# Altium schematic sheet balloon_system.SchDoc
size A4
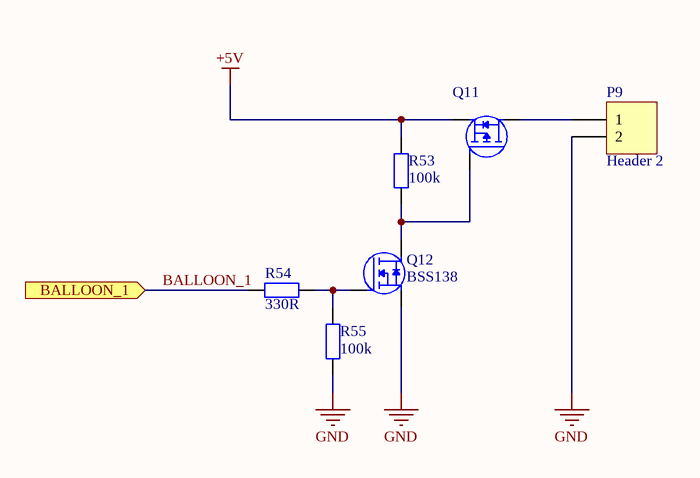
[diagram p0: balloon_system.SchDoc]

## Parts
P9  Header 2  [HDR1X2]  (no BOM)
Q11  SISH625DN-T1-GE3  [SISH625DN]  (value not drawn)  (no BOM)
Q12  BSS138  [SOT23]  (no BOM)
R53  100k  [R0603_IPC_MD]  (no BOM)
R54  330R  [R0603_IPC_MD]  (no BOM)
R55  100k  [R0603_IPC_MD]  (no BOM)

## Ports
BALLOON_1 (in)

## Nets
+5V: Q11.1(S) R53.1
GND: P9.2 Q12.2(S) R55.2
BALLOON_1: R54.2 ; port BALLOON_1
NetP9_1: P9.1 Q11.3(D)
NetQ11_2: Q11.2(G) Q12.3(D) R53.2
NetQ12_1: Q12.1(G) R54.1 R55.1

## Library data of the parts
P9 = Header 2: Header, 2-Pin; LatestRevisionDate: 17-Jul-2002; LatestRevisionNote: Re-released for DXP Platform.; Publisher: Altium Limited
Q11 = SISH625DN-T1: P-Channel 30V 17.3A (Ta), 35A (Tc) 3.7W (Ta), 52W (Tc) Surface Mount PowerPAK® 1212-8SH; Manufacturer: Vishay Siliconix; Manufacturer Part Number: SISH625DN-T1-GE3; Supplier 1: Digi-Key; Supplier Part Number 1: SISH625DN-T1-GE3CT-ND
Q12 = BSS138: N-Channel Logic Level Enhancement Mode Field Effect Transistor; Manufacturer: Diodes Incorporated; Manufacturer Part Number: BSS138; Supplier 1: Digi-Key; Supplier Part Number 1: BSS138-FDICT-ND
R53 R55 = RMCF0603FT100K: RES 100K OHM 1% 1/10W 0603; Manufacturer: Bourns Inc.; Value: 100k; Tolarance: 1%; Manufacturer Part Number: RMCF0603FT100K; Supplier 1: Digi-Key; Supplier Part Number 1: RMCF0603FT100KCT-ND
R54 = CR0603-JW-331ELF: RES SMD 330 OHM 5% 1/10W 0603; Manufacturer: Bourns Inc.; Value: 330R; Tolarance: 5%; Manufacturer Part Number: CR0603-JW-331ELF; Supplier 1: Digi-Key; Supplier Part Number 1: CR0603-JW-331ELFCT-ND